# Altium schematic sheet STPR_LMTSW_SRV.SchDoc
size Letter; SheetNumber: 5; SheetTotal: 11; SPICEModelCacheESSCVQFR: <root> / <DocumentId>ESSCVQFR</DocumentId> / <CacheFrame Number="0"> / <Model Name="umk107bj105_a-t" Kind="CKT"> / <Text>* UMK107BJ105_A-T     SPICE MODEL  ( General Type ) / *-------------------------------------------------------------------------------------------------------- / * Model Generated by TAIYO YUDEN Corporation (http://www.ty-top.com) / * Version 1.0 / * TAIYO YUDEN Control No. 170508_130520 / * Copyright(c) 2012 TAIYO YUDEN CO.,LTD. All Rights Reserved. / *-------------------------------------------------------------------------------------------------------- / * / * Products Name : Multilayer Ceramic Capacitors / * / * Characteristics : / *     Capacitance : 1 uF , Rated Voltage : 50V , TCC : X5R / *     Case Size : 1.6 x 0.8 / 0.063 x 0.031 [mm/inch] , Thickness : 0.8 / 0.031 [mm/inch] / *     (Conditions: Temperature = 25 degC , DC Bias Current/Voltage = 0A / 0V) / * / * Frequency Range : 40Hz - 3GHz / * / * External Node Assignments : / * / *  1  o---| |---o  2 / * / *-------------------------------------------------------------------------------------------------------- / .SubCkt UMK107BJ105_A-T 1 2 / **************************** / C0 1 110 0.79929u / Cm 1 101 0.13681u / C1 101 102 0.26224u / Rc1 101 102 5.8806k / C2 102 103 0.057839u / Rc2 102 103 469.42 / C3 103 110 0.014568u / Rc3 103 110 14.853 / C2m 1 301 0.13283u / C21 301 302 1.2593u / Rc21 301 302 6.3079k / C22 302 303 1.1189u / Rc22 302 303 6.9405k / C23 303 304 1.1421u / Rc23 303 304 6.4848k / C24 304 305 0.36861u / Rc24 304 305 785 / C25 305 306 0.39327u / Rc25 305 306 637.41 / C26 306 307 0.27451u / Rc26 306 307 19.365 / C27 307 308 0.15295u / Rc27 307 308 23.239 / C28 308 309 0.17569u / Rc28 308 309 17.788 / C29 309 110 1420.6p / Rc29 309 110 1.9725 / Rp0 1 110 500Meg / L0 110 120 0.24088n / Lm 120 130 0.1369n / L1 120 121 0.1842n / RL1 121 130 0.29804 / L2 120 122 0.40657n / RL2 122 130 0.57395 / L3 120 123 0.85773n / RL3 123 130 0.82282 / CR 120 124 0.11463u / LR 124 125 0.25983n / RR 125 130 52.447m / CL 130 140 1.4637p / LL 130 140 0.23986n / RL 130 140 33.985 / Rs 140 2 6.8539m / **************************** / .ends UMK107BJ105_A-T</Text> / </Model> / </CacheFrame> / </root>
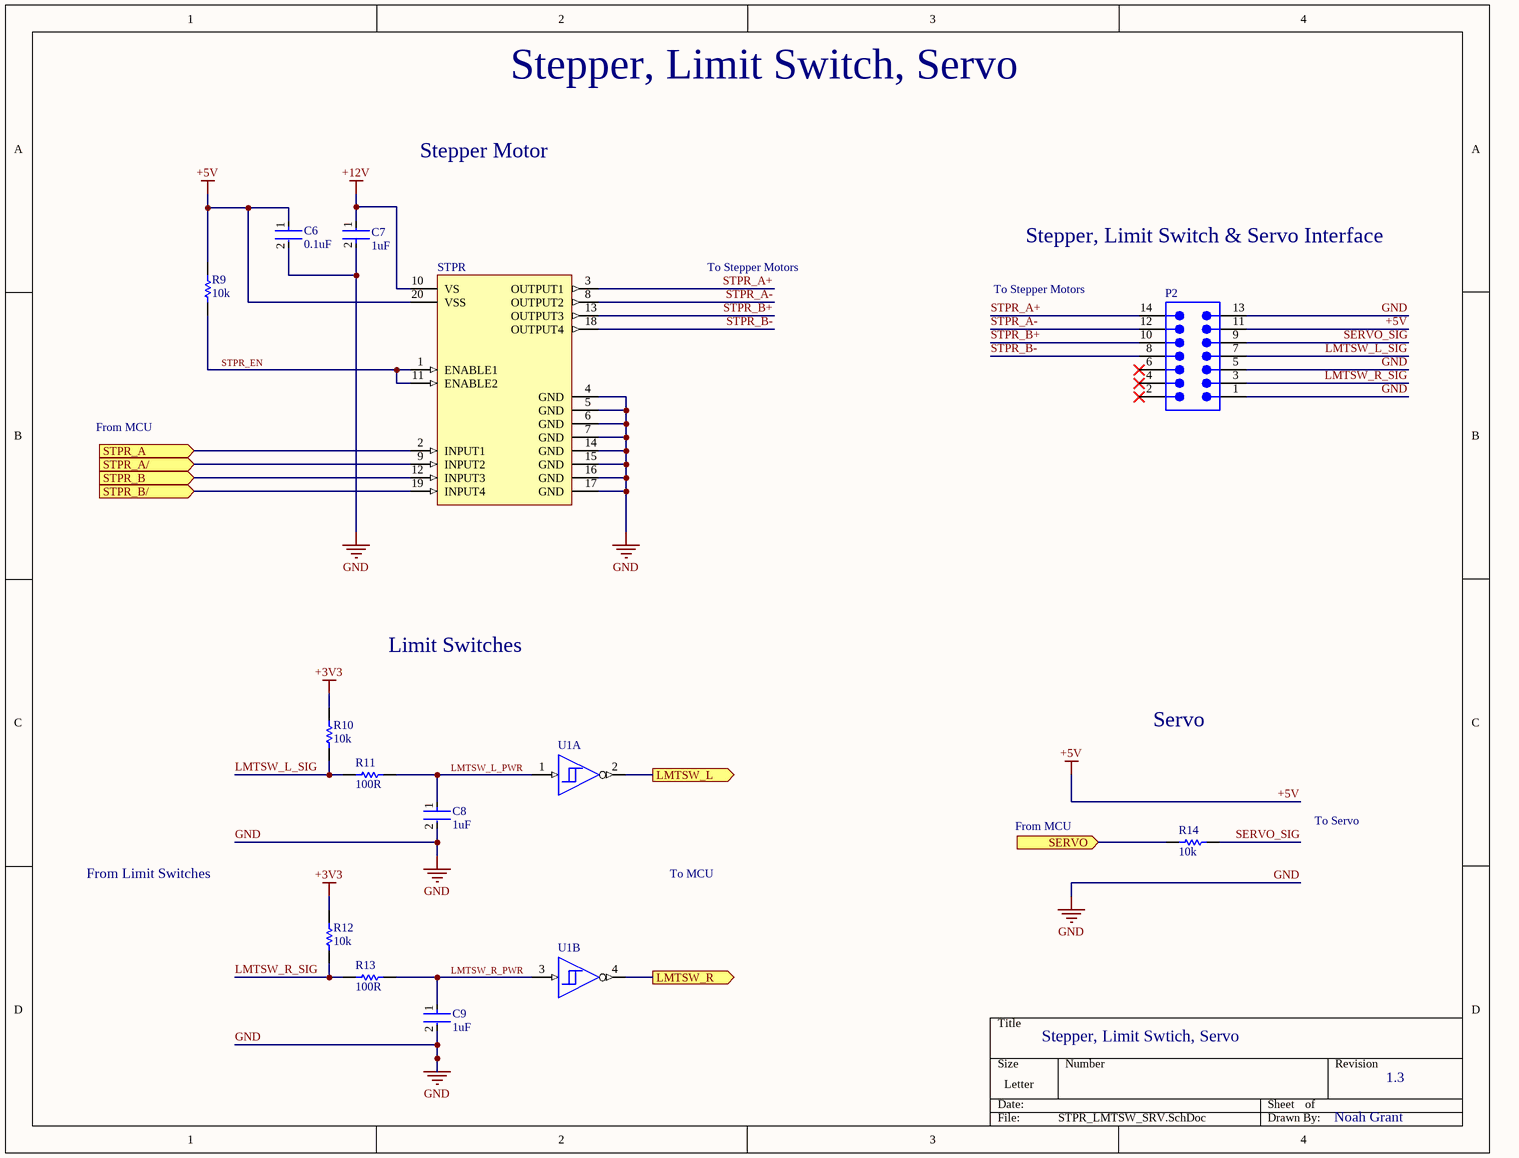
[diagram p0: STPR_LMTSW_SRV.SchDoc]

## Parts
C6  0.1uF  [FP-CC0603-DA-MFG]
C7  1uF  [FP-C1608-080-0_1-MFG]
C8  1uF  [FP-0603-L_1_6_0_1-W_0_8_0-IPC_A]
C9  1uF  [FP-0603-L_1_6_0_1-W_0_8_0-IPC_A]
P2  TSW-107-06-L-D  [SMTC-TSW-107-06-X-D]  (value not drawn)
R9  10k  [RESC1609X50X30NL8T20]
R10  10k  [RESC1609X50X30NL8T20]
R11  100R  [RESC1609X50X30ML8T20]
R12  10k  [RESC1609X50X30NL8T20]
R13  100R  [RESC1609X50X30ML8T20]
R14  10k  [RESC1609X50X30NL8T20]
STPR  L293DD  [STM-SOIC-20_M]  (value not drawn)
U1  SN74HC14PWT  [PW0014A_M]  (value not drawn)  (parts A,B of 7)

## Ports
LMTSW_L (out, see Top_Sheet[1B], Debug[3B], Nucleo[4B]), LMTSW_R (out, see Top_Sheet[1B], Debug[3B], Nucleo[4B]), SERVO (in, see Top_Sheet[1B], Debug[3B], Nucleo[4C]), STPR_A (in, see Top_Sheet[1B], Debug[3B], Nucleo[2C]), STPR_A/ (in, see Top_Sheet[1B], Debug[3B], Nucleo[2C]), STPR_B (in, see Top_Sheet[1B], Debug[3B], Nucleo[1C]), STPR_B/ (in, see Top_Sheet[1B], Debug[3B], Nucleo[1C])

## Nets
+3V3: R10.2 R12.2
+5V: C6.1 P2.11 R9.2 STPR.20(VSS)
+12V: C7.1 STPR.10(VS)
GND: C6.2 C7.2 C8.2 C9.2 P2.1 P2.5 P2.13 STPR.4(GND) STPR.5(GND) STPR.6(GND) STPR.7(GND) STPR.14(GND) STPR.15(GND) STPR.16(GND) STPR.17(GND)
LMTSW_L: U1.2(~{1Y}) ; port LMTSW_L
LMTSW_L_PWR: C8.1 R11.1 U1.1(1A)
LMTSW_L_SIG: P2.7 R10.1 R11.2
LMTSW_R: U1.4(~{2Y}) ; port LMTSW_R
LMTSW_R_PWR: C9.1 R13.1 U1.3(2A)
LMTSW_R_SIG: P2.3 R12.1 R13.2
SERVO: R14.1 ; port SERVO
SERVO_SIG: P2.9 R14.2
STPR_A: STPR.2(INPUT1) ; port STPR_A
STPR_A+: P2.14 STPR.3(OUTPUT1)
STPR_A-: P2.12 STPR.8(OUTPUT2)
STPR_A/: STPR.9(INPUT2) ; port STPR_A/
STPR_B: STPR.12(INPUT3) ; port STPR_B
STPR_B+: P2.10 STPR.13(OUTPUT3)
STPR_B-: P2.8 STPR.18(OUTPUT4)
STPR_B/: STPR.19(INPUT4) ; port STPR_B/
STPR_EN: R9.1 STPR.1(ENABLE1) STPR.11(ENABLE2)

Not connected (* = marked no-connect by the designer): P2 2* 4* 6*

## Notes on the sheet
- Stepper, Limit Switch, Servo
- Stepper Motor
- To Stepper Motors
- Stepper, Limit Switch & Servo Interface
- From MCU
- Limit Switches
- Servo
- To Servo
- From Limit Switches
- To MCU
- Stepper, Limit Swtich, Servo
- 1.3
- Noah Grant

## Library data of the parts
C6 = CMP-03422-000468-1: CAP CER 0.1UF 50V X7R 0603; Manufacturer: YAGEO; Manufacturer Part Number: CC0603KPX7R9BB104; Temperature Coefficient: 15%; Capacitance: 100 nF; Description: CC0603 100 nF X7R 10.00% 50 V; Material: Ceramic; Value: 100 nF; Tolerance: 0.1; Device Class L1: Passive Components; Temperature Range High: +125°C; ComponentLink2Description: Datasheet; Temperature Characteristic: X7R; Octopart: https://octopart.com/cc0603kpx7r9bb104-yageo-12885113; Height: 0.9mm; Mouser Description: Multilayer Ceramic Capacitors MLCC - SMD/SMT 100nF 50V X7R 10%; Device Class L3: Ceramic Capacitors; Voltage Rating: 50 V; Device Class L2: Capacitors; ComponentLink2URL: http://www.yageo.com/documents/recent/UPY-GPHC_X7R_6.3V-to-50V_18.pdf; Package: CC0603-DA; Automotive: No; Voltage: 50 V; RoHS: TRUE; Lead Free: Yes; Digikey Description: CAP CER 0.1UF 50V X7R 0603; Footprint Url: http://www.yageo.com/exep/pages/download/literatures/UPY-C_GEN_24.pdf; Temperature Range Low: -55°C; Temperature: -55°C to +125°C; Category: Cap
C7 = CMP-08246-006763-1: Multilayer Ceramic Capacitors 1μF ±10% 25V X6S SMD 0603; Dielectric: X6S; Capacitance: 1uF; Construction: Flat; Case/Package: 0603; Tolerance: 10%; Dielectric Material: Ceramic; Lead Free: Lead Free; Series: C; Case Code (Metric): 1608; Width: 0.031inch; Weight: 7.1E-05oz; Voltage Rating: 25V; Depth: 0.8mm; Packaging: Tape and Reel; Termination: SMD/SMT; Voltage Rating (DC): 25V; Mount: Surface Mount; Height: 0.8mm; Max Operating Temperature: 105°C; Min Operating Temperature: -55°C; Case Code (Imperial): 0603; Package Quantity: 4000; Length: 1.6mm; Thickness: 0.035inch; RoHS Compliant: Yes
C8 C9 = CMP-2000-05447-3: None; Tolerance: 10%; Voltage Rating: 50V; Dielectric: X5R; Height: 0.8mm; Depth: 0.8mm; Number of Pins: 2; Length: 1.6mm; Thickness: 0.035inch; Contact Plating: Nickel; Radiation Hardening: No; Package Quantity: 1; Case/Package: 0603; Capacitance: 1uF; Halogen Free: Halogen Free; RoHS Compliant: Yes; Termination: SMD/SMT; Max Operating Temperature: 85°C; Min Operating Temperature: -55°C; Case Code (Metric): 1608; Construction: Flat; Voltage Rating (DC): 50V; Packaging: Tape and Reel; Series: M; Case Code (Imperial): 0603; Width: 0.031inch; Mount: Surface Mount
P2 = CMP-1024-00406-1: 0.025" SQ Post Header, Through-hole, Vertical, -55 to 125 degC, 2.54 mm Pitch, 14-Pin, Male, RoHS; Manufacturer: Samtec; Pitch: 2.54 mm; RoHS: True; PackageVersion: DM, 8/1988; Mounting Technology: Through-hole; ComponentLink1Description: Manufacturer URL; Orientation: Vertical; PartNumber: TSW-107-06-L-D; Temperature Range: -55 to 125 degC; ComponentLink3URL: http://www.samtec.com/documents/webfiles/cpdf/TSW-XXX-XX-XXX-X-XX-XXX-MKT.pdf; PackageDescription: .025[0.64] SQ. Post Terminal Strip Assembly; PackageReference: TSW-107-06-X-D; ComponentLink2Description: Datasheet; ComponentLink3Description: Package Specification; ComponentLink1URL: http://www.samtec.com; DatasheetVersion: F-214; ComponentLink2URL: http://www.samtec.com/documents/webfiles/pdf/TSW_TH.PDF
R9 R10 R12 R14 = CMP-1666-00005-4: Chip Resistor, 10 KOhm, +/- 1%, 100 mW, -55 to 155 degC, 0603 (1608 Metric), RoHS, Tape and Reel; Manufacturer: Vishay Semiconductor; Voltage Rating: 75 V; Max Operating Temperature: 155 degC; PackageDescription: 2-Pin Surface Mount Device, Body 1.575 x 0.85 mm; ComponentLink1Description: Manufacturer URL; RoHSCompliant: true; PackageReference: 0603; REACH SVHC: Unknown; Length: 1.55 mm; DatasheetVersion: 06/2012; Packaging: Tape and Reel; Min Operating Temperature: -55 degC; Mounting Technology: Surface Mount; ComponentLink2URL: https://datasheet.ciiva.com/11809/0900766b80d98afc-11809037.pdf; Height: 0.45 mm; ComponentLink2Description: Datasheet; Package Quantity: 5000; ComponentLink1URL: http://www.vishay.com/
R11 R13 = CMP-2000-03824-5: Chip Resistor, 100 Ohm, +/- 1%, 100 mW,-55 to 155 degC, 0603 (1608 Metric), RoHS, Tape and Ree; Manufacturer: Vishay Semiconductor; ComponentLink2URL: http://www.vishay.com/docs/20035/dcrcwe3.pdf; ComponentLink1URL: http://www.vishay.com/; Mounting Technology: Surface Mount; ComponentLink1Description: Manufacturer URL; ComponentLink2Description: Datasheet; PackageDescription: 2-Pin Surface Mount Device, Body 1.575 x 0.85 mm; PackageReference: 0603; DatasheetVersion: 06/2012
STPR = CMP-1771-00003-1: Push-Pull Four Channel Driver with Diodes, 4.5 to 36 V, 20-Pin SOIC, RoHS, Tube; Voltage Rating: 50 V; Power Rating: 100 mW; Case\Package: 0603; Resistance: 15 kohm; Tolerance: 1%; REACH SVHC: Unknown; Case Code (Imperial): 0603; ComponentLink2Description: Datasheet; ComponentLink2URL: http://www.st.com/content/ccc/resource/technical/document/datasheet/04/ac/22/f9/20/5d/43/a1/CD00000059.pdf/files/CD00000059.pdf/jcr:content/translations/en.CD00000059.pdf; Max Operating Temperature: 155 degC; Width: 0.8 mm; ComponentLink1URL: http://www.st.com/; ComponentLink1Description: Manufacturer URL; Length: 1.6 mm; Package Quantity: 5000; RoHSCompliant: true; Height: 0.45 mm; Mount: Surface Mount; PackageDescription: 20-Pin Small Outline Integrated Circuit, Body 12.8 x 7.5 mm, Pitch 1.27 mm; PackageReference: SOIC-20; Packaging: Tape and Reel; Min Operating Temperature: -55 degC; Case Code (Metric): 1608; DatasheetVersion: Jul-03
U1 = CMP-1615-00108-4: Hex Schmitt-Trigger Inverters, PW0014A, SMALL T&R; Manufacturer: Texas Instruments; F @ Nom Voltage(Max)(Mhz): 20; Input Type: CMOS; VCC(Min)(V): 2; Bits(#): 6; Output Drive (IOL/IOH)(Max)(mA): -4/4; Technology Family: HC; Rating: Catalog; Voltage(Nom)(V): 5; ICC @ Nom Voltage(Max)(mA): 0.02; Schmitt Trigger: Yes; tpd @ Nom Voltage(Max)(ns): 31; Operating Temperature Range(C): -40 to 85; Output Type: CMOS; DatasheetVersion: SCLS085G; Generic Part Number: SN74HC14; VCC(Max)(V): 6; Code_JEDEC: MO-153; PackageReference: PW0014A